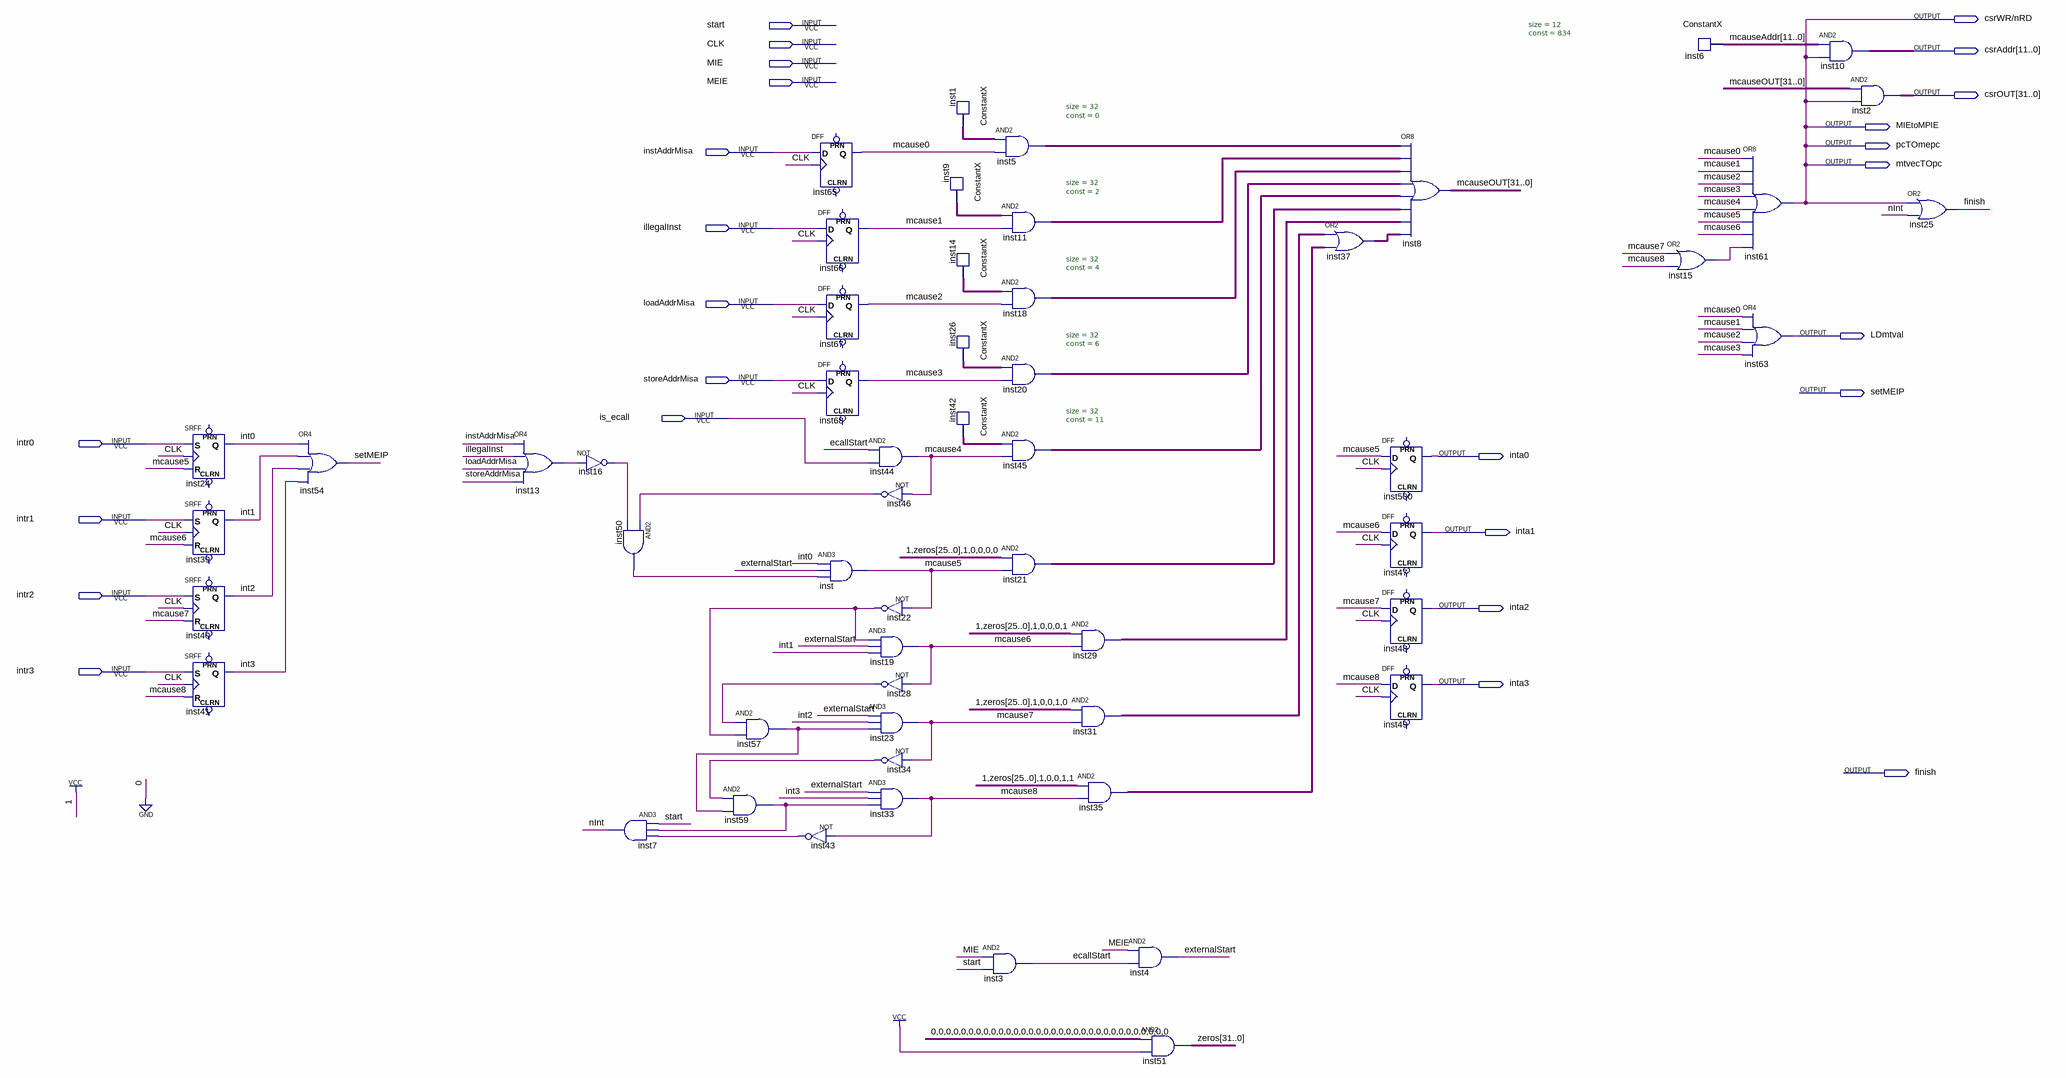
[diagram p0: schematic sheet]
// Quartus schematic InterruptFaza.bdf as structural Verilog: 55 symbols, 26 pins
module InterruptFaza (
  input  start,
  input  CLK,
  input  MIE,
  input  MEIE,
  input  instAddrMisa,
  input  illegalInst,
  input  loadAddrMisa,
  input  storeAddrMisa,
  input  is_ecall,
  input  intr0,
  input  intr1,
  input  intr2,
  input  intr3,
  output \csrWR/nRD ,
  output [11:0] csrAddr,
  output [31:0] csrOUT,
  output MIEtoMPIE,
  output pcTOmepc,
  output mtvecTOpc,
  output LDmtval,
  output setMEIP,
  output inta0,
  output inta1,
  output inta2,
  output inta3,
  output finish
);

  wire ecallStart, externalStart, inst13_out, inst15_out, inst16_out, inst22_out, inst28_out, inst34_out,
       inst43_out, inst46_out, inst50_out, inst57_out, inst59_out, int0, int1, int2, int3, mcause0, mcause1,
       mcause2, mcause3, mcause4, mcause5, mcause6, mcause7, mcause8, nInt;
  wire [11:0] mcauseAddr;
  wire [31:0] inst1_data_out, inst5_out, inst9_data_out, inst11_out, inst14_data_out, inst18_out, inst20_out,
       inst21_out, inst26_data_out, inst29_out, inst31_out, inst35_out, inst37_out, inst42_data_out,
       inst45_out, mcauseOUT, zeros;

  SRFF inst24 (.S(intr0), .R(mcause5), .CLK(CLK), .Q(int0));  // open: PRN, CLRN
  SRFF inst39 (.S(intr1), .R(mcause6), .CLK(CLK), .Q(int1));  // open: PRN, CLRN
  SRFF inst40 (.S(intr2), .R(mcause7), .CLK(CLK), .Q(int2));  // open: PRN, CLRN
  SRFF inst41 (.S(intr3), .R(mcause8), .CLK(CLK), .Q(int3));  // open: PRN, CLRN
  or inst54 (setMEIP, int0, int1, int2, int3);
  or inst13 (inst13_out, instAddrMisa, illegalInst, loadAddrMisa, storeAddrMisa);
  not inst16 (inst16_out, inst13_out);
  and inst50 (inst50_out, inst46_out, inst16_out);
  and inst7 (nInt, start, inst59_out, inst43_out);
  and inst57 (inst57_out, inst28_out, inst22_out);
  and inst59 (inst59_out, inst34_out, inst57_out);
  DFF inst65 (.CLK(CLK), .D(instAddrMisa), .Q(mcause0));  // open: CLRN, PRN
  DFF inst66 (.CLK(CLK), .D(illegalInst), .Q(mcause1));  // open: CLRN, PRN
  DFF inst67 (.CLK(CLK), .D(loadAddrMisa), .Q(mcause2));  // open: CLRN, PRN
  DFF inst68 (.CLK(CLK), .D(storeAddrMisa), .Q(mcause3));  // open: CLRN, PRN
  and inst (mcause5, int0, externalStart, inst50_out);
  not inst43 (inst43_out, mcause8);
  and inst44 (mcause4, ecallStart, is_ecall);
  not inst46 (inst46_out, mcause4);
  not inst22 (inst22_out, mcause5);
  and inst19 (mcause6, inst22_out, externalStart, int1);
  not inst28 (inst28_out, mcause6);
  and inst23 (mcause7, externalStart, int2, inst57_out);
  not inst34 (inst34_out, mcause7);
  and inst33 (mcause8, externalStart, int3, inst59_out);
  ConstantX #(.size(32), .\const (0)) inst1 (.DATA_OUT(inst1_data_out));
  ConstantX #(.size(32), .\const (2)) inst9 (.DATA_OUT(inst9_data_out));
  ConstantX #(.size(32), .\const (4)) inst14 (.DATA_OUT(inst14_data_out));
  ConstantX #(.size(32), .\const (6)) inst26 (.DATA_OUT(inst26_data_out));
  ConstantX #(.size(32), .\const (11)) inst42 (.DATA_OUT(inst42_data_out));
  assign inst5_out = inst1_data_out & {32{mcause0}};  // AND2 inst5, 32 bits wide
  and inst3 (ecallStart, MIE, start);
  assign inst11_out = inst9_data_out & {32{mcause1}};  // AND2 inst11, 32 bits wide
  assign inst18_out = inst14_data_out & {32{mcause2}};  // AND2 inst18, 32 bits wide
  assign inst20_out = inst26_data_out & {32{mcause3}};  // AND2 inst20, 32 bits wide
  assign inst45_out = inst42_data_out & {32{mcause4}};  // AND2 inst45, 32 bits wide
  assign inst21_out = {1'b1, zeros[25:0], 5'b10000} & {32{mcause5}};  // AND2 inst21, 32 bits wide
  assign inst29_out = {1'b1, zeros[25:0], 5'b10001} & {32{mcause6}};  // AND2 inst29, 32 bits wide
  assign inst31_out = {1'b1, zeros[25:0], 5'b10010} & {32{mcause7}};  // AND2 inst31, 32 bits wide
  assign inst35_out = {1'b1, zeros[25:0], 5'b10011} & {32{mcause8}};  // AND2 inst35, 32 bits wide
  and inst4 (externalStart, MEIE, ecallStart);
  assign zeros = {32{1'b0}} & {32{1'b1}};  // AND2 inst51, 32 bits wide
  assign inst37_out = inst31_out | inst35_out;  // OR2 inst37, 32 bits wide
  assign mcauseOUT = inst5_out | inst11_out | inst18_out | inst20_out | inst45_out | inst21_out | inst29_out | inst37_out;  // OR8 inst8, 32 bits wide
  DFF inst500 (.CLK(CLK), .D(mcause5), .Q(inta0));  // open: CLRN, PRN
  DFF inst47 (.CLK(CLK), .D(mcause6), .Q(inta1));  // open: CLRN, PRN
  DFF inst48 (.CLK(CLK), .D(mcause7), .Q(inta2));  // open: CLRN, PRN
  DFF inst49 (.CLK(CLK), .D(mcause8), .Q(inta3));  // open: CLRN, PRN
  ConstantX #(.size(12), .\const (834)) inst6 (.DATA_OUT(mcauseAddr));
  or inst15 (inst15_out, mcause7, mcause8);
  or inst61 (\csrWR/nRD , mcause0, mcause1, mcause2, mcause3, mcause4, mcause5, mcause6, inst15_out);
  or inst63 (LDmtval, mcause0, mcause1, mcause2, mcause3);
  assign csrAddr = mcauseAddr & {12{\csrWR/nRD }};  // AND2 inst10, 12 bits wide
  assign csrOUT = mcauseOUT & {32{\csrWR/nRD }};  // AND2 inst2, 32 bits wide
  or inst25 (finish, \csrWR/nRD , nInt);

  assign MIEtoMPIE = \csrWR/nRD ;
  assign mtvecTOpc = \csrWR/nRD ;
  assign pcTOmepc = \csrWR/nRD ;
endmodule
